# Altium project esp32c3-haptic-motor-controller.PrjPcb (part 1 of 3)
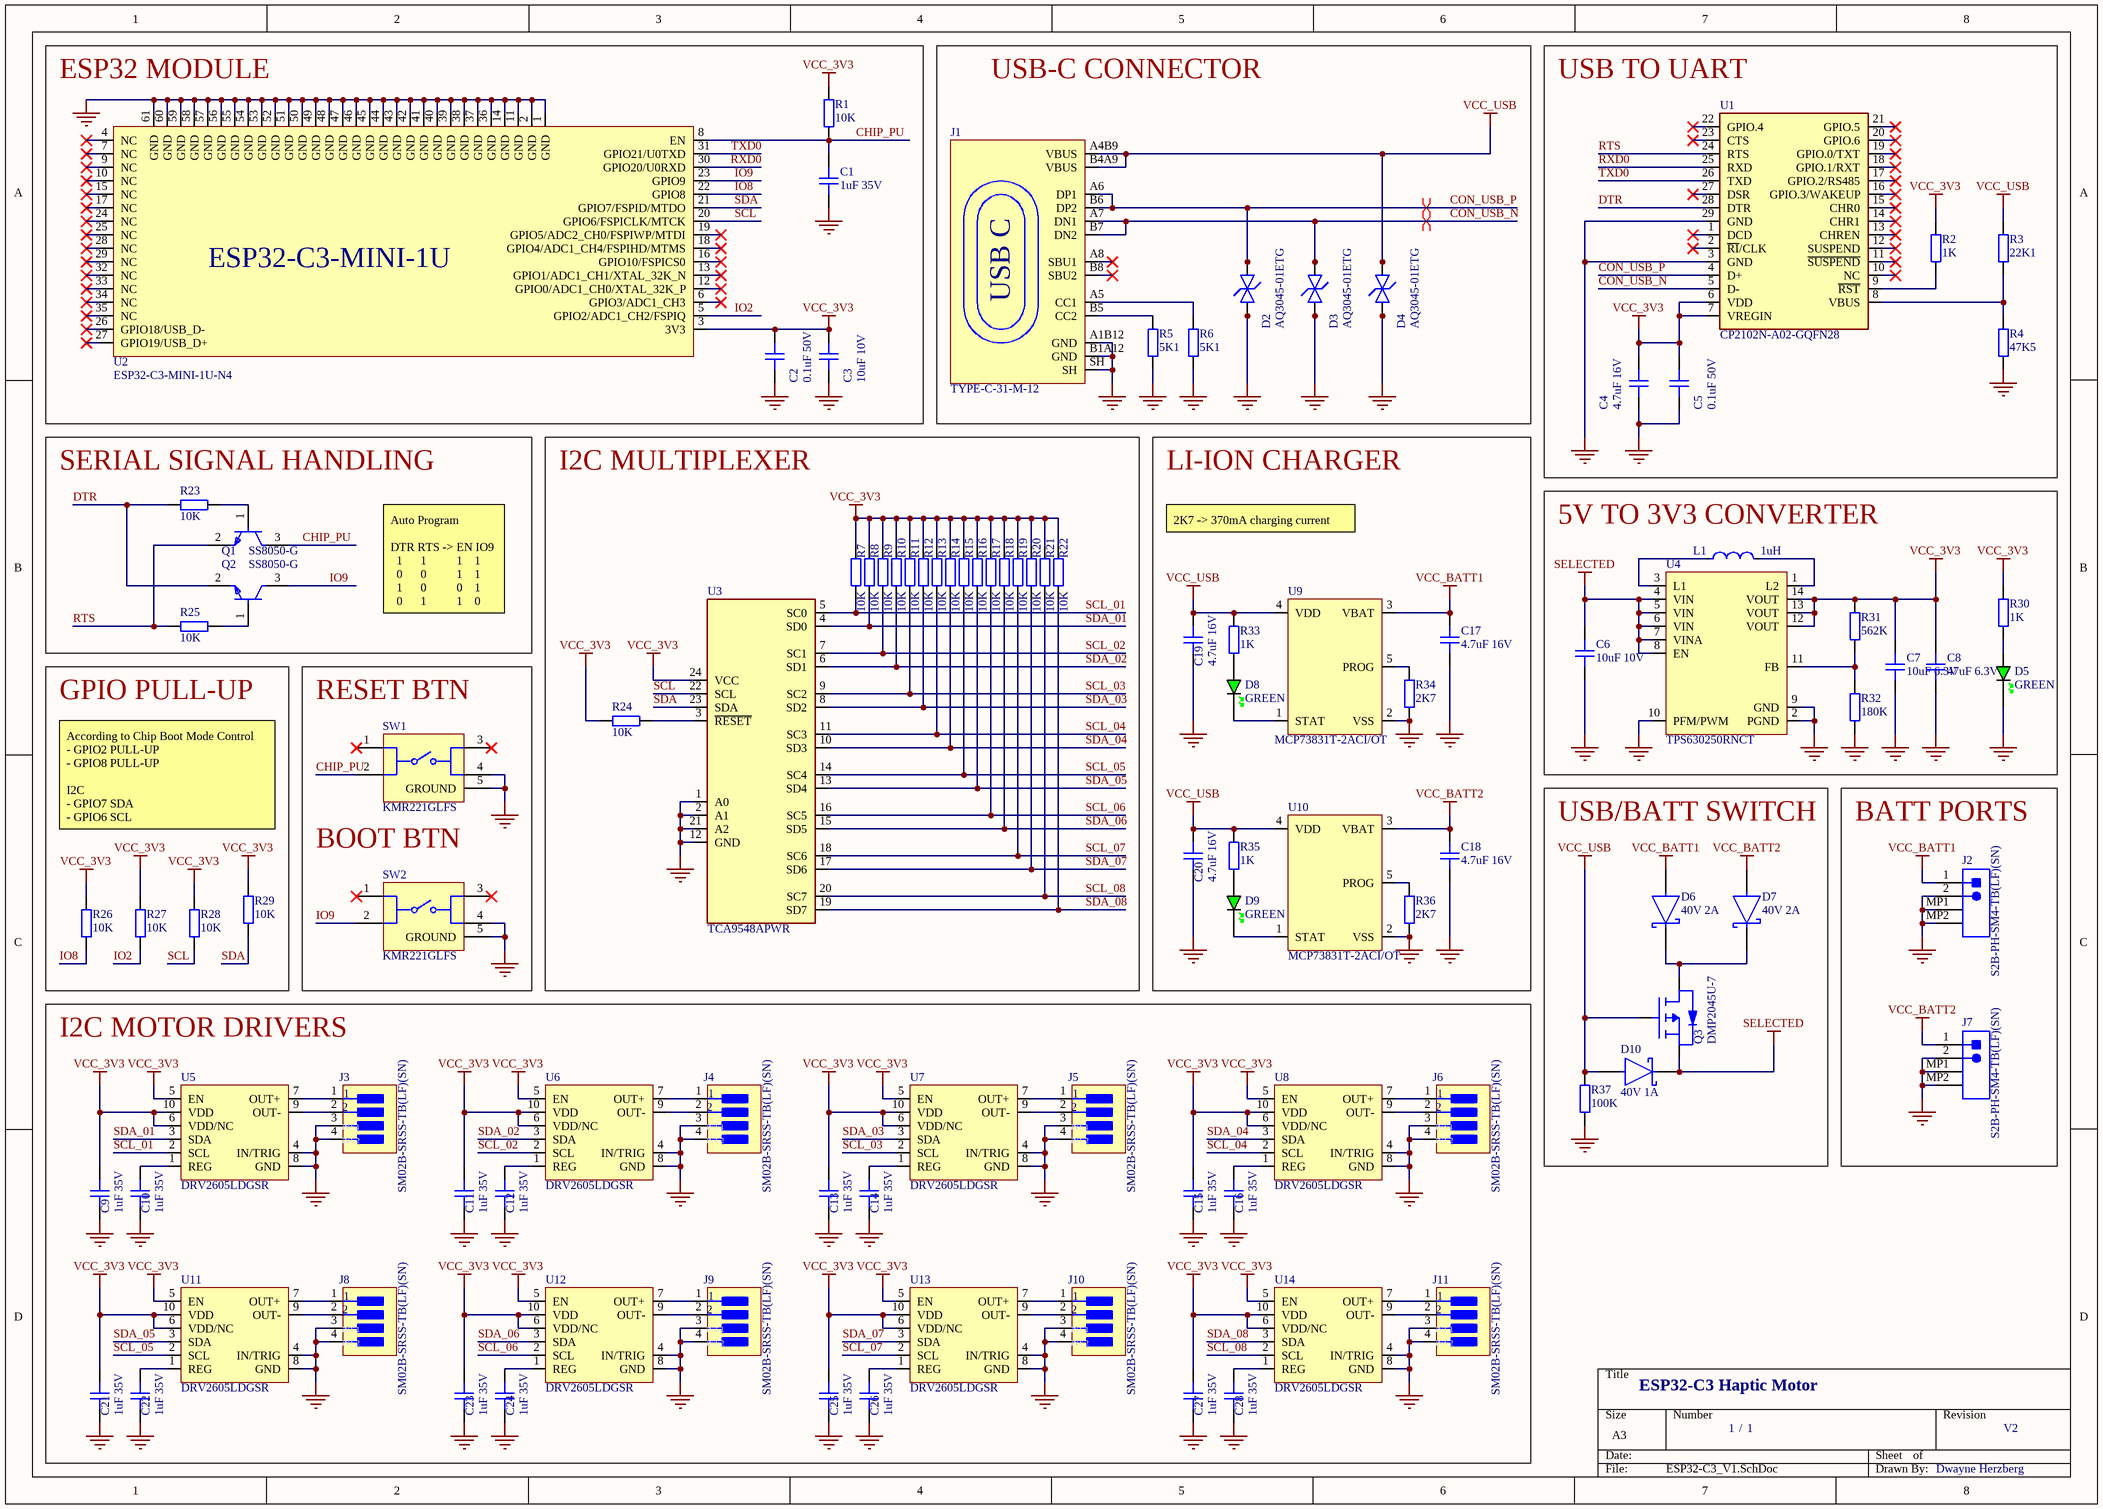
[diagram p0: ESP32-C3_V1.SchDoc]
1 sheet, 105 parts. Net scope: global (net labels, ports and power ports of the same name join across sheets).
Board file: ESP32-C3_V1.PcbDoc

## Sheet ESP32-C3_V1.SchDoc: ESP32-C3 Haptic Motor
size A3; Author: Dwayne Herzberg; DrawnBy: Dwayne Herzberg; Revision: V2; SheetNumber: 1; SheetTotal: 1

### Parts
C1  1uF 35V  [CAP_0402]
C2  0.1uF 50V  [CAP_0402]
C3  10uF 10V  [CAP_0402]
C4  4.7uF 16V  [CAP_0402]
C5  0.1uF 50V  [CAP_0402]
C6  10uF 10V  [CAP_0603]
C7  10uF 6.3V  [CAP_0603]
C8  47uF 6.3V  [CAP_0805]
C9  1uF 35V  [CAP_0402]
C10  1uF 35V  [CAP_0402]
C11  1uF 35V  [CAP_0402]
C12  1uF 35V  [CAP_0402]
C13  1uF 35V  [CAP_0402]
C14  1uF 35V  [CAP_0402]
C15  1uF 35V  [CAP_0402]
C16  1uF 35V  [CAP_0402]
C17  4.7uF 16V  [CAP_0402]
C18  4.7uF 16V  [CAP_0402]
C19  4.7uF 16V  [CAP_0402]
C20  4.7uF 16V  [CAP_0402]
C21  1uF 35V  [CAP_0402]
C22  1uF 35V  [CAP_0402]
C23  1uF 35V  [CAP_0402]
C24  1uF 35V  [CAP_0402]
C25  1uF 35V  [CAP_0402]
C26  1uF 35V  [CAP_0402]
C27  1uF 35V  [CAP_0402]
C28  1uF 35V  [CAP_0402]
D2  AQ3045-01ETG  [SP353001ETG]
D3  AQ3045-01ETG  [SP353001ETG]
D4  AQ3045-01ETG  [SP353001ETG]
D5  GREEN  [LED_0603_GREEN]
D6  40V 2A  [FP-DO-214AC-MFG]
D7  40V 2A  [FP-DO-214AC-MFG]
D8  GREEN  [LED_0603_GREEN]
D9  GREEN  [LED_0603_GREEN]
D10  40V 1A  [FP-SOD123-IPC_B]
J1  TYPE-C-31-M-12  [TYPE-C-31-M-12]
J2  S2B-PH-SM4-TB(LF)(SN)  [JST- S2B-PH-SM4-TB(LF)(SN)-2_V]
J3  SM02B-SRSS-TB(LF)(SN)  [FP-SM02B-SRSS-TB_LF_SN-MFG]
J4  SM02B-SRSS-TB(LF)(SN)  [FP-SM02B-SRSS-TB_LF_SN-MFG]
J5  SM02B-SRSS-TB(LF)(SN)  [FP-SM02B-SRSS-TB_LF_SN-MFG]
J6  SM02B-SRSS-TB(LF)(SN)  [FP-SM02B-SRSS-TB_LF_SN-MFG]
J7  S2B-PH-SM4-TB(LF)(SN)  [JST- S2B-PH-SM4-TB(LF)(SN)-2_V]
J8  SM02B-SRSS-TB(LF)(SN)  [FP-SM02B-SRSS-TB_LF_SN-MFG]
J9  SM02B-SRSS-TB(LF)(SN)  [FP-SM02B-SRSS-TB_LF_SN-MFG]
J10  SM02B-SRSS-TB(LF)(SN)  [FP-SM02B-SRSS-TB_LF_SN-MFG]
J11  SM02B-SRSS-TB(LF)(SN)  [FP-SM02B-SRSS-TB_LF_SN-MFG]
L1  1uH  [FP-XAL4020-102MEC-MFG]
Q1  SS8050-G  [FP-SS8050-G-IPC_B]
Q2  SS8050-G  [FP-SS8050-G-IPC_B]
Q3  DMP2045U-7  [SOT96P240X115-3N]
R1  10K  [RES_0402]
R2  1K  [RES_0402]
R3  22K1  [RES_0402]
R4  47K5  [RES_0402]
R5  5K1  [RES_0402]
R6  5K1  [RES_0402]
R7  10K  [RES_0402]
R8  10K  [RES_0402]
R9  10K  [RES_0402]
R10  10K  [RES_0402]
R11  10K  [RES_0402]
R12  10K  [RES_0402]
R13  10K  [RES_0402]
R14  10K  [RES_0402]
R15  10K  [RES_0402]
R16  10K  [RES_0402]
R17  10K  [RES_0402]
R18  10K  [RES_0402]
R19  10K  [RES_0402]
R20  10K  [RES_0402]
R21  10K  [RES_0402]
R22  10K  [RES_0402]
R23  10K  [RES_0402]
R24  10K  [RES_0402]
R25  10K  [RES_0402]
R26  10K  [RES_0402]
R27  10K  [RES_0402]
R28  10K  [RES_0402]
R29  10K  [RES_0402]
R30  1K  [RES_0402]
R31  562K  [RES_0603]
R32  180K  [RES_0603]
R33  1K  [RES_0402]
R34  2K7  [RES_0402]
R35  1K  [RES_0402]
R36  2K7  [RES_0402]
R37  100K  [RES_0402]
SW1  KMR221GLFS  [FP-KMR221GLFS-MFG]
SW2  KMR221GLFS  [FP-KMR221GLFS-MFG]
U1  CP2102N-A02-GQFN28  [FP-CP2102N-A02-GQFN28-IPC_B]
U2  ESP32-C3-MINI-1U-N4  [ESP32-C3-MINI-1U_EXP]
U3  TCA9548APWR  [FP-PW0024A-IPC_B]
U4  TPS630250RNCT  [FP-RNC0014A-MFG]
U5  DRV2605LDGSR  [FP-DGS0010A-IPC_B]
U6  DRV2605LDGSR  [FP-DGS0010A-IPC_B]
U7  DRV2605LDGSR  [FP-DGS0010A-IPC_B]
U8  DRV2605LDGSR  [FP-DGS0010A-IPC_B]
U9  MCP73831T-2ACI/OT  [FP-C04-091-OT-IPC_B]
U10  MCP73831T-2ACI/OT  [FP-C04-091-OT-IPC_B]
U11  DRV2605LDGSR  [FP-DGS0010A-IPC_B]
U12  DRV2605LDGSR  [FP-DGS0010A-IPC_B]
U13  DRV2605LDGSR  [FP-DGS0010A-IPC_B]
U14  DRV2605LDGSR  [FP-DGS0010A-IPC_B]

### Blocks framed on the sheet
ESP32 MODULE: C1-C3 R1 U2
USB-C CONNECTOR: D2-D4 J1 R5 R6
USB TO UART: C4 C5 R2-R4 U1
SERIAL SIGNAL HANDLING: Q1 Q2 R23 R25
I2C MULTIPLEXER: R7-R22 R24 U3
LI-ION CHARGER: C17-C20 D8 D9 R33-R36 U9 U10
5V TO 3V3 CONVERTER: C6-C8 D5 L1 R30-R32 U4
GPIO PULL-UP: R26-R29
USB/BATT SWITCH: D6 D7 D10 Q3 R37
BATT PORTS: J2 J7
I2C MOTOR DRIVERS: C9-C16 C21-C28 J3-J6 J8-J11 U5-U8 U11-U14

### Nets
GND: C1.1 C2.1 C3.1 C4.1 C5.1 C6.1 C7.1 C8.1 C9.1 C10.1 C11.1 C12.1 C13.1 C14.1 C15.1 C16.1 C17.2 C18.2 C19.2 C20.2 C21.1 C22.1 C23.1 C24.1 C25.1 C26.1 C27.1 C28.1 D2.1(A) D2.A D3.1(A) D3.A D4.1(A) D4.A D5.K J1.A1B12(GND) J1.B1A12(GND) J1.SH J2.2 J2.MP1 J2.MP2 J3.3(MNT_1) J3.4(MNT_2) J4.3(MNT_1) J4.4(MNT_2) J5.3(MNT_1) J5.4(MNT_2) J6.3(MNT_1) J6.4(MNT_2) J7.2 J7.MP1 J7.MP2 J8.3(MNT_1) J8.4(MNT_2) J9.3(MNT_1) J9.4(MNT_2) J10.3(MNT_1) J10.4(MNT_2) J11.3(MNT_1) J11.4(MNT_2) R4.1 R5.1 R6.1 R32.1 R34.2 R36.2 R37.1 SW1.4 SW1.5(GROUND) SW2.4 SW2.5(GROUND) U1.3(GND) U1.29(GND) U2.1(GND) U2.2(GND) U2.11(GND) U2.14(GND) U2.36(GND) U2.37(GND) U2.38(GND) U2.39(GND) U2.40(GND) U2.41(GND) U2.42(GND) U2.43(GND) U2.44(GND) U2.45(GND) U2.46(GND) U2.47(GND) U2.48(GND) U2.49(GND) U2.50(GND) U2.51(GND) U2.52(GND) U2.53(GND) U2.54(GND) U2.55(GND) U2.56(GND) U2.57(GND) U2.58(GND) U2.59(GND) U2.60(GND) U2.61(GND) U3.1(A0) U3.2(A1) U3.12(GND) U3.21(A2) U4.2(PGND) U4.9(GND) U4.10(PFM/PWM) U5.4(IN/TRIG) U5.8(GND) U6.4(IN/TRIG) U6.8(GND) U7.4(IN/TRIG) U7.8(GND) U8.4(IN/TRIG) U8.8(GND) U9.2(VSS) U10.2(VSS) U11.4(IN/TRIG) U11.8(GND) U12.4(IN/TRIG) U12.8(GND) U13.4(IN/TRIG) U13.8(GND) U14.4(IN/TRIG) U14.8(GND)
SELECTED: C6.2 D10.1(C) Q3.2(S) U4.4(VIN) U4.5(VIN) U4.6(VIN) U4.7(VINA) U4.8(EN)
VCC_3V3: C2.2 C3.2 C4.2 C5.2 C7.2 C8.2 C9.2 C11.2 C13.2 C15.2 C21.2 C23.2 C25.2 C27.2 R1.2 R2.2 R7.2 R8.2 R9.2 R10.2 R11.2 R12.2 R13.2 R14.2 R15.2 R16.2 R17.2 R18.2 R19.2 R20.2 R21.2 R22.2 R24.2 R26.2 R27.2 R28.2 R29.2 R30.2 R31.2 U1.6(VDD) U1.7(VREGIN) U2.3(3V3) U3.24(VCC) U4.12(VOUT) U4.13(VOUT) U4.14(VOUT) U5.5(EN) U5.6(VDD/NC) U5.10(VDD) U6.5(EN) U6.6(VDD/NC) U6.10(VDD) U7.5(EN) U7.6(VDD/NC) U7.10(VDD) U8.5(EN) U8.6(VDD/NC) U8.10(VDD) U11.5(EN) U11.6(VDD/NC) U11.10(VDD) U12.5(EN) U12.6(VDD/NC) U12.10(VDD) U13.5(EN) U13.6(VDD/NC) U13.10(VDD) U14.5(EN) U14.6(VDD/NC) U14.10(VDD)
VCC_BATT1: C17.1 D6.2(A) J2.1 U9.3(VBAT)
VCC_BATT2: C18.1 D7.2(A) J7.1 U10.3(VBAT)
VCC_USB: C19.1 C20.1 D4.2(K) D4.K D10.2(A) J1.A4B9(VBUS) J1.B4A9(VBUS) Q3.1(G) R3.2 R33.1 R35.1 R37.2 U9.4(VDD) U10.4(VDD)
CHIP_PU: C1.2 Q1.3(C) R1.1 SW1.2 U2.8(EN)
CON_USB_N: D3.2(K) D3.K J1.A7(DN1) J1.B7(DN2) U1.5(D-)
CON_USB_P: D2.2(K) D2.K J1.A6(DP1) J1.B6(DP2) U1.4(D+)
DTR: Q2.2(E) R23.2 U1.28(DTR)
IO2: R27.1 U2.5(GPIO2/ADC1_CH2/FSPIQ)
IO8: R26.1 U2.22(GPIO8)
IO9: Q2.3(C) SW2.2 U2.23(GPIO9)
RTS: Q1.2(E) R25.2 U1.24(RTS)
RXD0: U1.25(RXD) U2.30(GPIO20/U0RXD)
SCL: R28.1 U2.20(GPIO6/FSPICLK/MTCK) U3.22(SCL)
SCL_01: R7.1 U3.5(SC0) U5.2(SCL)
SCL_02: R9.1 U3.7(SC1) U6.2(SCL)
SCL_03: R11.1 U3.9(SC2) U7.2(SCL)
SCL_04: R13.1 U3.11(SC3) U8.2(SCL)
SCL_05: R15.1 U3.14(SC4) U11.2(SCL)
SCL_06: R17.1 U3.16(SC5) U12.2(SCL)
SCL_07: R19.1 U3.18(SC6) U13.2(SCL)
SCL_08: R21.1 U3.20(SC7) U14.2(SCL)
SDA: R29.1 U2.21(GPIO7/FSPID/MTDO) U3.23(SDA)
SDA_01: R8.1 U3.4(SD0) U5.3(SDA)
SDA_02: R10.1 U3.6(SD1) U6.3(SDA)
SDA_03: R12.1 U3.8(SD2) U7.3(SDA)
SDA_04: R14.1 U3.10(SD3) U8.3(SDA)
SDA_05: R16.1 U3.13(SD4) U11.3(SDA)
SDA_06: R18.1 U3.15(SD5) U12.3(SDA)
SDA_07: R20.1 U3.17(SD6) U13.3(SDA)
SDA_08: R22.1 U3.19(SD7) U14.3(SDA)
TXD0: U1.26(TXD) U2.31(GPIO21/U0TXD)
NetC10_2: C10.2 U5.1(REG)
NetC12_2: C12.2 U6.1(REG)
NetC14_2: C14.2 U7.1(REG)
NetC16_2: C16.2 U8.1(REG)
NetC22_2: C22.2 U11.1(REG)
NetC24_2: C24.2 U12.1(REG)
NetC26_2: C26.2 U13.1(REG)
NetC28_2: C28.2 U14.1(REG)
NetD5_A: D5.A R30.1
NetD6_1: D6.1(C) D7.1(C) Q3.3(D)
NetD8_A: D8.A R33.2
NetD8_K: D8.K U9.1(STAT)
NetD9_A: D9.A R35.2
NetD9_K: D9.K U10.1(STAT)
NetJ1_A5: J1.A5(CC1) R6.2
NetJ1_B5: J1.B5(CC2) R5.2
NetJ3_1: J3.1 U5.7(OUT+)
NetJ3_2: J3.2 U5.9(OUT-)
NetJ4_1: J4.1 U6.7(OUT+)
NetJ4_2: J4.2 U6.9(OUT-)
NetJ5_1: J5.1 U7.7(OUT+)
NetJ5_2: J5.2 U7.9(OUT-)
NetJ6_1: J6.1 U8.7(OUT+)
NetJ6_2: J6.2 U8.9(OUT-)
NetJ8_1: J8.1 U11.7(OUT+)
NetJ8_2: J8.2 U11.9(OUT-)
NetJ9_1: J9.1 U12.7(OUT+)
NetJ9_2: J9.2 U12.9(OUT-)
NetJ10_1: J10.1 U13.7(OUT+)
NetJ10_2: J10.2 U13.9(OUT-)
NetJ11_1: J11.1 U14.7(OUT+)
NetJ11_2: J11.2 U14.9(OUT-)
NetL1_1: L1.1 U4.3(L1)
NetL1_2: L1.2 U4.1(L2)
NetQ1_1: Q1.1(B) R23.1
NetQ2_1: Q2.1(B) R25.1
NetR2_1: R2.1 U1.9(~{RST})
NetR3_1: R3.1 R4.2 U1.8(VBUS)
NetR24_1: R24.1 U3.3(~{RESET})
NetR31_1: R31.1 R32.2 U4.11(FB)
NetR34_1: R34.1 U9.5(PROG)
NetR36_1: R36.1 U10.5(PROG)

Not connected (* = marked no-connect by the designer): J1 A8(SBU1)* B8(SBU2)*; SW1 1* 3*; SW2 1* 3*; U1 1(DCD)* 2(~{RI}/CLK)* 10(NC)* 11(~{SUSPEND})* 12(SUSPEND)* 13(CHREN)* 14(CHR1)* 15(CHR0)* 16(GPIO.3/WAKEUP)* 17(GPIO.2/RS485)* 18(GPIO.1/RXT)* 19(GPIO.0/TXT)* 20(GPIO.6)* 21(GPIO.5)* 22(GPIO.4)* 23(CTS)* 27(DSR)*; U2 4(NC)* 6(GPIO3/ADC1_CH3)* 7(NC)* 9(NC)* 10(NC)* 12(GPIO0/ADC1_CH0/XTAL_32K_P)* 13(GPIO1/ADC1_CH1/XTAL_32K_N)* 15(NC)* 16(GPIO10/FSPICS0)* 17(NC)* 18(GPIO4/ADC1_CH4/FSPIHD/MTMS)* 19(GPIO5/ADC2_CH0/FSPIWP/MTDI)* 24(NC)* 25(NC)* 26(GPIO18/USB_D-)* 27(GPIO19/USB_D+)* 28(NC)* 29(NC)* 32(NC)* 33(NC)* 34(NC)* 35(NC)*

### Layout directives
differential pair: CON_USB_N, CON_USB_P

### Notes on the sheet
- 2K7 -> 370mA charging current
- Auto Program
  DTR RTS -> EN IO9
  1      1          1    1
  0      0          1    1
  1      0          0    1
  0      1          1    0
- (near SW1) RESET BTN
- According to Chip Boot Mode Control
  - GPIO2 PULL-UP
  - GPIO8 PULL-UP
  I2C
  - GPIO7 SDA
  - GPIO6 SCL
- BOOT BTN
- /
- (in symbol ESP32-C3-MINI-1U-N4) ESP32-C3-MINI-1U
- (in symbol TYPE-C-31-M-12) USB C